# EAGLE design MC34063 Through hole (EAGLE 6.1)
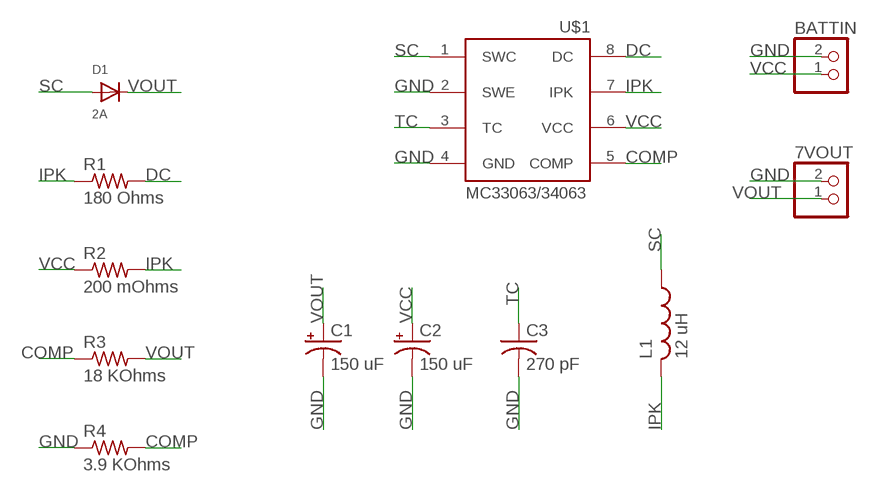
[diagram p0: schematic, sheet 1]

## Parts
7VOUT  JST_2PIN-THM-RA  [JST-PH-2-THM-RA]
BATTIN  JST_2PIN-THM-RA  [JST-PH-2-THM-RA]
C1  150 uF  CPOL-USE2-5  [E2-5]
C2  150 uF  CPOL-USE2-5  [E2-5]
C3  270 pF  C-US050-024X044  [C050-024X044]
D1  2A  DIODEDO-1N4148  [DO-1N4148]
L1  12 uH  L-US0207/5V  [0207/5V]
R1  180 Ohms  R-US_0207/2V  [0207/2V]
R2  200 mOhms  R-US_0207/2V  [0207/2V]
R3  18 KOhms  R-US_0207/2V  [0207/2V]
R4  3.9 KOhms  R-US_0207/2V  [0207/2V]
U$1  MC33063/MC34063P  [DIL08]

## Nets
COMP: R3.1 R4.2 U$1.5(COMP)
DC: R1.2 U$1.8(DC)
GND: 7VOUT.2 BATTIN.2 C1.- C2.- C3.2 R4.1 U$1.2(SWE) U$1.4(GND)
IPK: L1.2 R1.1 R2.2 U$1.7(IPK)
SC: D1.A L1.1 U$1.1(SWC)
TC: C3.1 U$1.3(TC)
VCC: BATTIN.1 C2.+ R2.1 U$1.6(VCC)
VOUT: 7VOUT.1 C1.+ D1.C R3.2

## Library data of the parts
7VOUT BATTIN = adafruit:JST_2PIN: JST 2-Pin Connectors of various flavors SMT-RA (S2B-PH-SM4) 4UConnector #17311 SMT (B2B-PH-SM4) THM-RA (S2B-PH) THM (B2B-PH)
C1 C2 = resistor:CPOL-US: POLARIZED CAPACITOR, American symbol
C3 = resistor:C-US: CAPACITOR, American symbol
D1 = adafruit:DIODE: Diode SMADIODE - SMA Surface Mount Package 20V 1A Schottky Diode Digikey: 641-1014-6-ND DO-1N4148 - Through Hole Small Current Diode SOD-123 20V 1 A (.5mV Vf) Schottky Diode - Digikey: MBRX120TPMSCT-ND SOD-323 10V 570mA (.38mV Vf, 3ns) Schottky Diode - Digikey: ZLLS410CT-ND SOD-523 30V 30mA Schottky Diode (RB751S-40TE61) - Digikey: RB751S-40TE61CT-ND SOT23-R/W - SOT23 Package (R = Solder Paste/Reflow Ovens, W = Hand-Soldering) BAT54Film 40V 300mA - Digikey: 497-7162-1-ND
L1 = resistor:L-US: INDUCTOR, American symbol
R1-R4 = resistor:R-US_: RESISTOR, American symbol
U$1 = adafruit:MC33063/MC34063: MC33063 and MC34063 Basic DC/DC converter with internal power-NPN transistor, 100KHz, 1.5A peak switch current. 3-40 input/output.

## Board
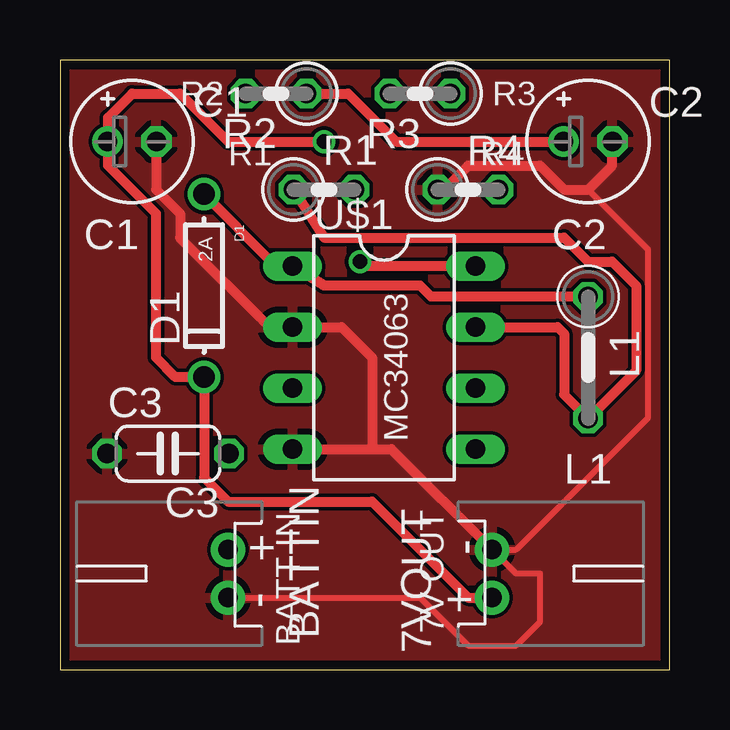
[diagram p1: board, top side]
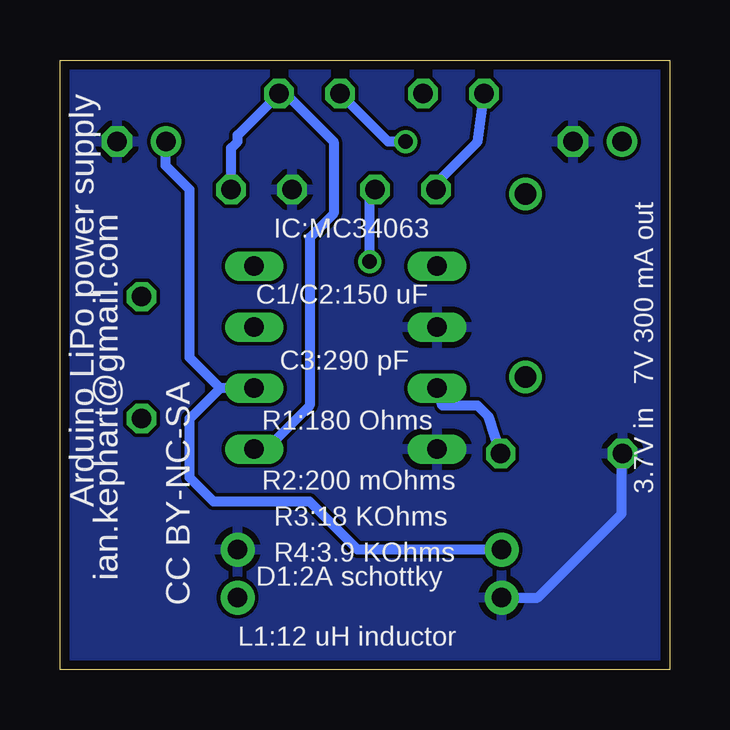
[diagram p2: board, bottom side, seen from below]

Size 25.4 x 25.4 mm. Coordinates in mm from the lower left corner, seen from the top.
Outline: 0,0 25.4,0 25.4,25.4 0,25.4 0,0
Copper layers (1*16): Top 0.0356mm / dielectric 1.5011mm / Bottom 0.0356mm
Design rules: minimum track width 6mil, minimum drill 13mil, track to track 6mil, track to pad 6mil, pad to pad 6mil, via to via 6mil, smd to smd 6mil, copper to edge 15mil, drill to drill 6mil, minimum pad ring 7mil, minimum via ring 7mil, stop-mask expansion 4mil, vias tented up to drill 0mil, thermal gap 10mil

### Footprints (pad centres in the part's own frame; a part is rotated, then mirrored left to right if it is on the bottom)
JST-PH-2-THM-RA = drill 0.8 pad 1.422: 1 1,0; 2 -1,0
E2-5 = drill 0.813 pad 1.27: + -1.016,0 | drill 0.813 pad 1.27 octagon: - 1.016,0
C050-024X044 = drill 0.813 octagon: 1 -2.54,0; 2 2.54,0
DO-1N4148 = drill 0.9: A -3.81,0; C 3.81,0
0207/5V = drill 0.813 octagon: 1 -2.54,0; 2 2.54,0
0207/2V = drill 0.813 octagon: 1 -1.27,0; 2 1.27,0
DIL08 = drill 0.813 long: 1 -3.81,-3.81; 2 -1.27,-3.81; 3 1.27,-3.81; 4 3.81,-3.81; 5 3.81,3.81; 6 1.27,3.81; 7 -1.27,3.81; 8 -3.81,3.81

### Placement (x,y rotation side)
7VOUT  18,4 270 top
BATTIN  7,4 90 top
C1  3,22 0 top
C2  22,22 0 top
C3  4.5,9 180 top
D1  6,16 270 top
L1  22,13 270 top
R1  11,20 0 top
R2  9,24 180 top
R3  15,24 180 top
R4  17,20 0 top
U$1  13.5,13 270 top

### Tracks (layer width: path | path; a pad name or v marks a point on that pad's centre or on a via)
COMP
  Bottom 0.406: U$1.5 18,9 17,9 15,11 15,18 14,19 14,22 16,24 R3.1 18,22.27 18,22 18.27,21.73 R4.2
DC  (via drill 0.6)
  Top 0.406: U$1.8 12.69,16.81 v12.5,17
  Bottom 0.406: v12.5,17 12.5,19.77 R1.2
GND
  Top 0.254: BATTIN.2 15,3 17,1 19,1 20,2 20,4 19,4 7VOUT.2 19,5 24.5,10.5 24.5,17.5 22,20
  Top 0.406: R4.1 16,20 17,21 20,21 21,20 22,20 23,21 23,21.98 C2.- | C1.- 4.02,20.02 4,20 5,19 5,18 8.73,14.27 U$1.2 11.73,14.27 13,13 13,9.19 | U$1.4 13,9.19 | 13,9.19 13.81,9.19 7VOUT.2
  Bottom 0.406: BATTIN.2 5.5,3 2,6.5 2,9
  pour Bottom: 0,25.5 25.5,25.5 25.5,0 0,0
  pour Top: 0,25.5 25.5,25.5 25.5,0 0,0
IPK
  Top 0.406: R1.1 11,18 21,18 22,17 23,17 24,16 24,12.46 L1.2 21,11.46 21,14 20.73,14.27 U$1.7
  Bottom 0.406: R1.1 9.73,20.27 8,22 R2.2
SC
  Top 0.406: L1.1 15.46,15.54 15,16 11,16 U$1.1 | U$1.1 10,17 | U$1.1 9.19,16.81 9,17 8.81,17 D1.A
TC
  Bottom 0.406: C3.1 7.54,10.54 8,11 9.46,11 U$1.3
VCC
  Top 0.406: R2.1 12,24 14,22 C2.+
  Bottom 0.406: U$1.6 18.73,11.73 | 18.73,11.73 20,13 20,20 21,21 21,21.98 C2.+ | BATTIN.1 13,5 15,7 19,7 20,8 20,10.46 18.73,11.73
VOUT  (via drill 0.6)
  Top 0.406: 7VOUT.1 17,3 13,7 7,7 6,8 D1.C 4.81,12.19 4,13 4,19 2,21 2,21.98 C1.+ 2,22.02 2,23 3,24 5,24 7,22 v11,22
  Bottom 0.406: v11,22 11.73,22 R3.2

### Text on the board
_tsilk: R2 | R3 | R1 | R4 | C1 | C2 | D1 | C3 | MC34063 | L1 | BATT IN | 7V OUT
_bsilk: Arduino LiPo power supply | 3.7V in 7V 300 mA out | ian.kephart@gmail.com | IC:MC34063 | C1/C2:150 uF | C3:290 pF | CC BY-NC-SA | R1:180 Ohms | R2:200 mOhms | R3:18 KOhms | R4:3.9 KOhms | D1:2A schottky | L1:12 uH inductor